# EAGLE schematic 6502 (EAGLE 6.5.0)
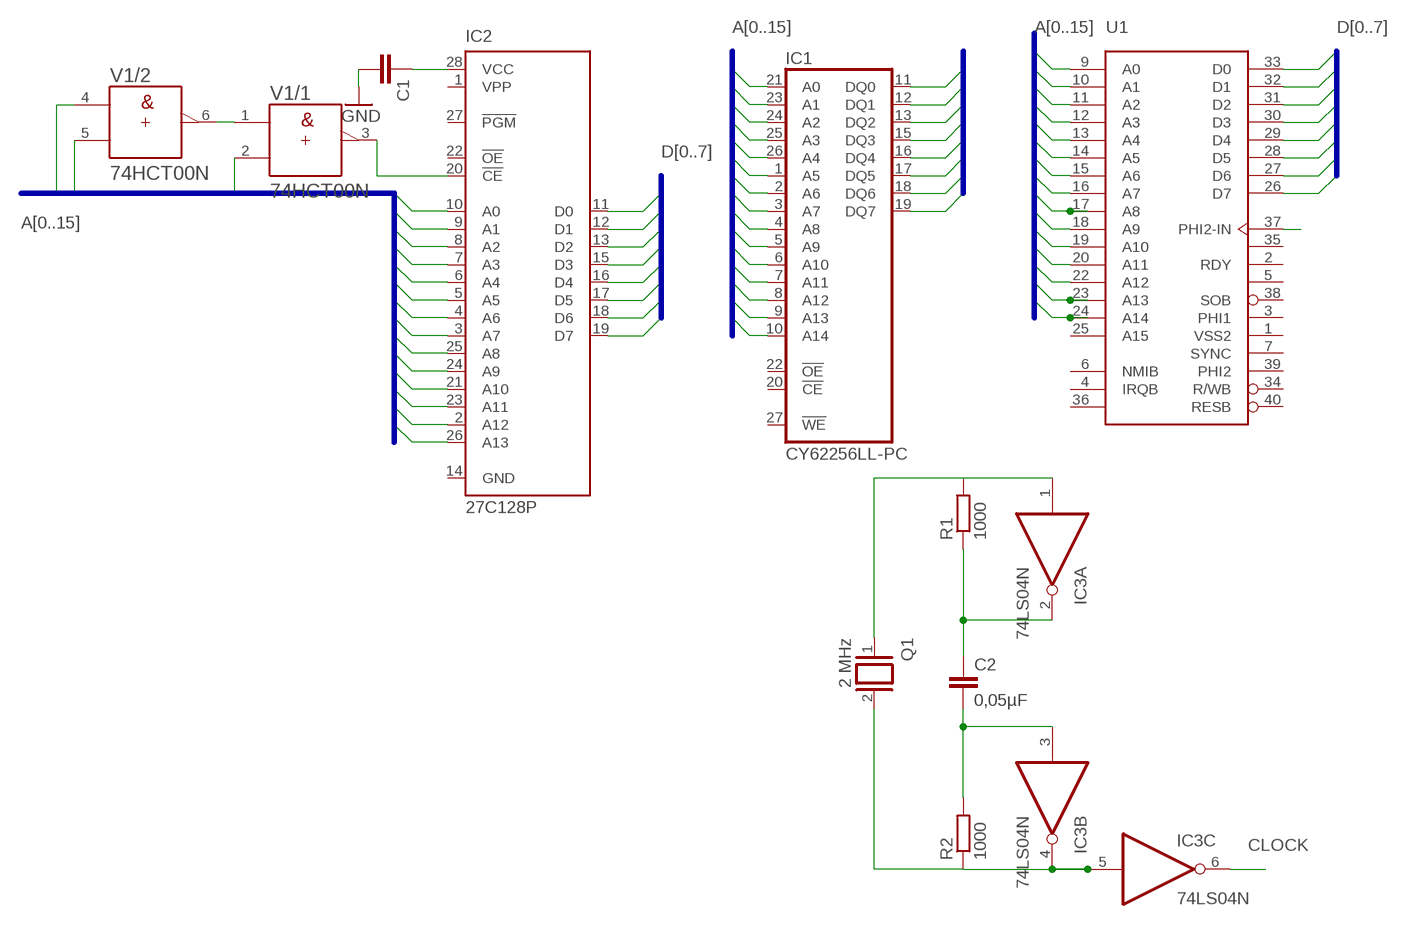
[diagram p0: schematic, sheet 1]

## Parts
C1  C5/3  [C5B3]
C2  0,05µF  C5/3  [C5B3]
IC1  CY62256LL-PC  [DIL28-6]
IC2  27C128P  [DIL28-6]
IC3  74LS04N  [DIL14]
Q1  2 MHz  XTAL/S  [QS]
R1  1000  R-EU_0204/7  [0204/7]
R2  1000  R-EU_0204/7  [0204/7]
U1  G65SC02P  [DIP-40]
V1  74HCT00N  [DIL14]

## Nets
A0: IC1.21(A0) IC2.10(A0) U1.9(A0)
A1: IC1.23(A1) IC2.9(A1) U1.10(A1)
A2: IC1.24(A2) IC2.8(A2) U1.11(A2)
A3: IC1.25(A3) IC2.7(A3) U1.12(A3)
A4: IC1.26(A4) IC2.6(A4) U1.13(A4)
A5: IC1.1(A5) IC2.5(A5) U1.14(A5)
A6: IC1.2(A6) IC2.4(A6) U1.15(A6)
A7: IC1.3(A7) IC2.3(A7) U1.16(A7)
A8: IC1.4(A8) IC2.25(A8) U1.17(A8)
A9: IC1.5(A9) IC2.24(A9) U1.18(A9)
A10: IC1.6(A10) IC2.21(A10) U1.19(A10)
A11: IC1.7(A11) IC2.23(A11) U1.20(A11)
A12: IC1.8(A12) IC2.2(A12) U1.22(A12)
A13: IC1.9(A13) IC2.26(A13) U1.23(A13) V1.4(/2:A)
A14: IC1.10(A14) U1.24(A14) V1.5(/2:B)
A15: V1.2(/1:B)
CLOCK: IC3.6(C:O) U1.37(PHI2-IN)
D0: IC1.11(DQ0) IC2.11(D0) U1.33(D0)
D1: IC1.12(DQ1) IC2.12(D1) U1.32(D1)
D2: IC1.13(DQ2) IC2.13(D2) U1.31(D2)
D3: IC1.15(DQ3) IC2.15(D3) U1.30(D3)
D4: IC1.16(DQ4) IC2.16(D4) U1.29(D4)
D5: IC1.17(DQ5) IC2.17(D5) U1.28(D5)
D6: IC1.18(DQ6) IC2.18(D6) U1.27(D6)
D7: IC1.19(DQ7) IC2.19(D7) U1.26(D7)
GND: C1.2
N$1: V1.1(/1:A) V1.6(/2:Y)
N$2: IC2.20(!CE) V1.3(/1:Y)
N$3: C1.1 IC2.28(VCC)
N$4: C2.1 IC3.2(A:O) R1.1
N$5: C2.2 IC3.3(B:I) R2.2
N$6: IC3.1(A:I) Q1.1 R1.2
XXX: IC3.4(B:O) IC3.5(C:I) Q1.2 R2.1
Unconnected: IC1.20(!CE) IC1.22(!OE) IC1.27(!WE) IC2.1(VPP) IC2.22(!OE) IC2.27(!PGM) IC3.8(D:O) IC3.9(D:I) IC3.10(E:O) IC3.11(E:I) IC3.12(F:O) IC3.13(F:I) U1.2(RDY) U1.3(PHI1) U1.4(IRQB) U1.5(NC$3) U1.6(NMIB) U1.7(SYNC) U1.25(A15) U1.34(R/WB) U1.35(NC$1) U1.36(NC$2) U1.38(SOB) U1.39(PHI2) U1.40(RESB) V1.8(/3:Y) V1.9(/3:A) V1.10(/3:B) V1.11(/4:Y) V1.12(/4:A) V1.13(/4:B)

## Buses
A[0..15]
D[0..7]

## Power pins joined to a net without a drawn wire
+UB: V1.14(/+UB:+UB)
-UB: V1.7(/-UB:-UB)
GND: IC1.14(GND) IC2.14(GND) IC3.7(P:GND)
VCC: IC1.28(VCC) IC3.14(P:VCC)
VDD: U1.8(VDD)
VSS: U1.21(VSS)
VSS2: U1.1(VSS2)

## Library data of the parts
C1 C2 = capacitor-wima:C: CAPACITOR naming: grid - package width
IC1 = memory-sram:CY62256LL-?*: 256K (32K x 8) CMOS-Static RAM Source: http://download.cypress.com.edgesuite.net/design_resources/datasheets/contents/cy62256_8.pdf
IC2 = microchip:27*128: CMOS EPROM 128 K (16 K x 8); OC_FARNELL: unknown; OC_NEWARK: unknown
IC3 = 74xx-us:74*04: Hex INVERTER
Q1 = special:XTAL/S: CRYSTAL
R1 R2 = resistor:R-EU_: RESISTOR, European symbol
U1 = 65XXX:G65SC02P
V1 = 74ttl-din:74*00: Quad 2-input NAND gate